# EAGLE design LedTester (EAGLE 7.3.0)
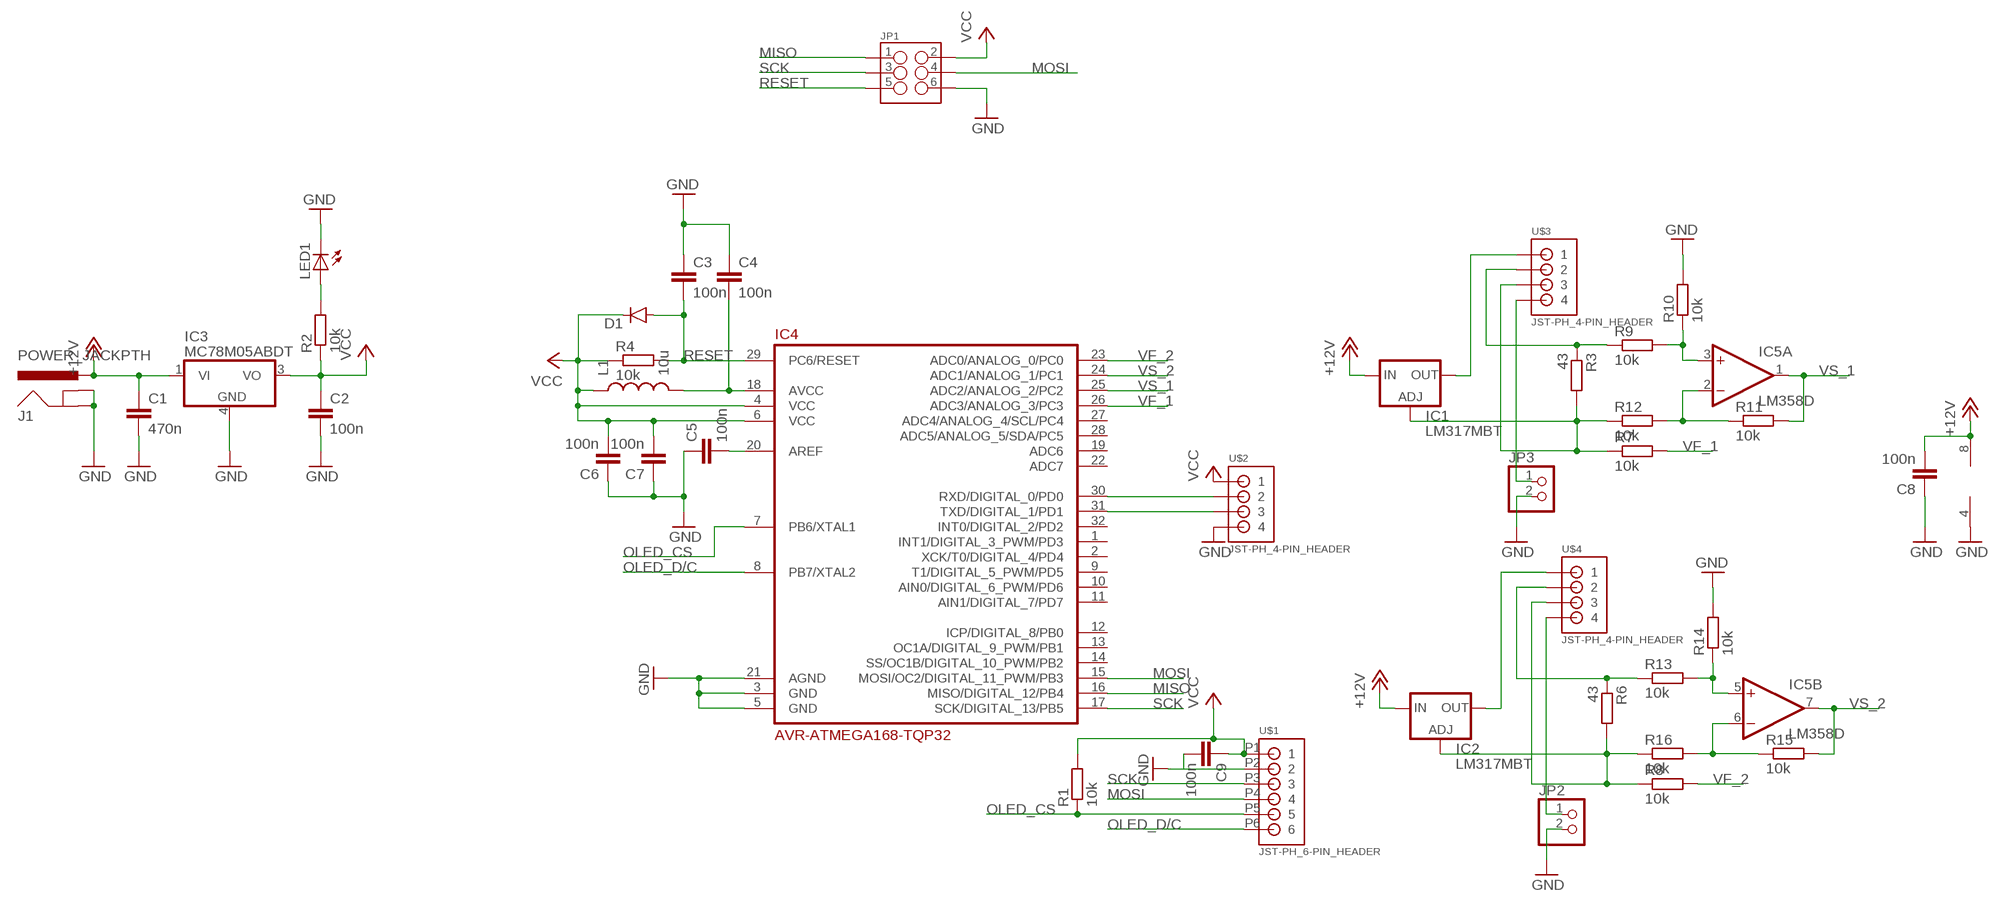
[diagram p0: schematic, sheet 1]

## Parts
C1  470n  C-EUC0603  [C0603]
C2  100n  C-EUC0603  [C0603]
C3  100n  C-EUC0603  [C0603]
C4  100n  C-EUC0603  [C0603]
C5  100n  C-EUC0603  [C0603]
C6  100n  C-EUC0603  [C0603]
C7  100n  C-EUC0603  [C0603]
C8  100n  C-EUC0603  [C0603]
C9  100n  C-EUC0603  [C0603]
D1  DIODESOD  [SOD-323]
IC1  LM317MBT  [TO220L1]
IC2  LM317MBT  [TO220L1]
IC3  MC78M05ABDT  [DPACK_3]
IC4  AVR-ATMEGA168-TQP32  [QFP32]
IC5  LM358D  [SO08]
J1  POWER_JACKPTH  [POWER_JACK_PTH]
JP1  M03X2SHROUD  [2X3-SHROUDED]
JP2  PINHD-1X2  [1X02]
JP3  PINHD-1X2  [1X02]
L1  10u  INDUCTOR0603  [0603]
LED1  LEDCHIP-LED0603  [CHIP-LED0603]
R1  10k  R-EU_R0603  [R0603]
R2  10k  R-EU_R0603  [R0603]
R3  43  R-EU_R0603  [R0603]
R4  10k  R-EU_R0603  [R0603]
R6  43  R-EU_R0603  [R0603]
R7  10k  R-EU_R0603  [R0603]
R8  10k  R-EU_R0603  [R0603]
R9  10k  R-EU_R0603  [R0603]
R10  10k  R-EU_R0603  [R0603]
R11  10k  R-EU_R0603  [R0603]
R12  10k  R-EU_R0603  [R0603]
R13  10k  R-EU_R0603  [R0603]
R14  10k  R-EU_R0603  [R0603]
R15  10k  R-EU_R0603  [R0603]
R16  10k  R-EU_R0603  [R0603]
U$1  JST-PH_6-PIN_HEADER  [JST_B6B-PH_HEADER]
U$2  JST-PH_4-PIN_HEADER  [JST_B4B-PH_HEADER]
U$3  JST-PH_4-PIN_HEADER  [JST_B4B-PH_HEADER]
U$4  JST-PH_4-PIN_HEADER  [JST_B4B-PH_HEADER]

## Nets
+12V: C1.1 C8.2 IC1.3(IN) IC2.3(IN) IC3.1(VI) IC5.8(P:V+) J1.PWR
GND: C1.2 C2.2 C3.1 C4.1 C5.1 C6.1 C7.1 C8.1 C9.2 IC3.4(GND) IC4.3(GND) IC4.5(GND) IC4.21(AGND) IC5.4(P:V-) J1.GND J1.GNDBREAK JP1.6 JP2.2 JP3.2 LED1.C R10.2 R14.2 U$1.P2 U$2.P4
MISO: IC4.16(MISO/DIGITAL_12/PB4) JP1.1
MOSI: IC4.15(MOSI/OC2/DIGITAL_11_PWM/PB3) JP1.4 U$1.P4
N$1: C5.2 IC4.20(AREF)
N$3: IC1.2(OUT) U$3.P1
N$4: C4.2 IC4.18(AVCC) L1.2
N$5: R3.1 R9.1 U$3.P2
N$6: IC1.1(ADJ) R3.2 R7.1 R12.1 U$3.P3
N$7: IC2.2(OUT) U$4.P1
N$8: R6.1 R13.1 U$4.P2
N$9: IC2.1(ADJ) R6.2 R8.1 R16.1 U$4.P3
N$10: LED1.A R2.2
N$11: IC4.30(RXD/DIGITAL_0/PD0) U$2.P2
N$12: IC4.31(TXD/DIGITAL_1/PD1) U$2.P3
N$13: IC5.2(A:-IN) R11.1 R12.2
N$14: IC5.3(A:+IN) R9.2 R10.1
N$15: IC5.6(B:-IN) R15.1 R16.2
N$16: IC5.5(B:+IN) R13.2 R14.1
N$17: JP3.1 U$3.P4
N$18: JP2.1 U$4.P4
OLED_CS: IC4.7(PB6/XTAL1) R1.1 U$1.P5
OLED_D/C: IC4.8(PB7/XTAL2) U$1.P6
RESET: C3.2 D1.A IC4.29(PC6/RESET) JP1.5 R4.2
SCK: IC4.17(SCK/DIGITAL_13/PB5) JP1.3 U$1.P3
VCC: C2.1 C6.2 C7.2 C9.1 D1.C IC3.3(VO) IC4.4(VCC) IC4.6(VCC) JP1.2 L1.1 R1.2 R2.1 R4.1 U$1.P1 U$2.P1
VF_1: IC4.26(ADC3/ANALOG_3/PC3) R7.2
VF_2: IC4.23(ADC0/ANALOG_0/PC0) R8.2
VS_1: IC4.25(ADC2/ANALOG_2/PC2) IC5.1(A:OUT) R11.2
VS_2: IC4.24(ADC1/ANALOG_1/PC1) IC5.7(B:OUT) R15.2
Unconnected: IC4.1(INT1/DIGITAL_3_PWM/PD3) IC4.2(XCK/T0/DIGITAL_4/PD4) IC4.9(T1/DIGITAL_5_PWM/PD5) IC4.10(AIN0/DIGITAL_6_PWM/PD6) IC4.11(AIN1/DIGITAL_7/PD7) IC4.12(ICP/DIGITAL_8/PB0) IC4.13(OC1A/DIGITAL_9_PWM/PB1) IC4.14(SS/OC1B/DIGITAL_10_PWM/PB2) IC4.19(ADC6) IC4.22(ADC7) IC4.27(ADC4/ANALOG_4/SCL/PC4) IC4.28(ADC5/ANALOG_5/SDA/PC5) IC4.32(INT0/DIGITAL_2/PD2)

## Library data of the parts
C1-C9 = rcl:C-EU: CAPACITOR, European symbol
D1 = SparkFun-DiscreteSemi:DIODE: Diode These are standard reverse protection diodes and small signal diodes. SMA package can handle up to about 1A. SOD-323 can handle about 200mA. What the SOD-323 package when ordering, there are some mfgs out there that are 5-pin packages.; PROD_ID: DIO-09646
IC1 IC2 = v-reg:LM317?*: 500 mA Adjustable Output Positive Voltage Regulator Source: http://www.onsemi.co.jp .. LM317M-D.PDF
IC3 = linear:MC78M: 500 mA Positive Voltage Regulators Source: Data sheet <http://www.onsemi.com/pub_link/Collateral/MC78M00-D.PDF>
IC4 = tidyeagle:AVR-ATMEGA168-TQP32: Atmel 8-bit Microcontroller in TQFP32 package. Datasheet: Summary <http://www.atmel.com/dyn/resources/prod_documents/8271S.pdf>, Full <http://www.atmel.com/dyn/resources/prod_documents/doc8271.pdf> Application Notes: AVR042 - Hardware Design Considerations <http://atmel.com/dyn/resources/prod_documents/doc2521.pdf> Supports the following chips - ATmega48PA ATmega88PA ATmega168PA ATmega328P With Arduino pin labelling.
IC5 = linear:LM358: OP AMP also LM158; LM258; LM2904 Source: http://cache.national.com/ds/LM/LM158.pdf
J1 = SparkFun-Connectors:POWER_JACK: Power Jack This is the standard 5.5mm barrel jack for power. The PTH is the most common, proven, reliable, footprint. The Slot footprint only works if the mill layer is transmitted to the PCB fab house so be warned. Mating wall wart : TOL-00298 (and others); PROD_ID: PRT-00119
JP1 = SparkFun-Connectors:M03X2: 2x3 .1" header. Shrouded, with keying- CONN-10681 SMT- CONN-11415 Pogo pins- HW-11044; PROD_ID: CONN-10681
JP2 JP3 = pinhead:PINHD-1X2: PIN HEADER
L1 = SparkFun-Passives:INDUCTOR: Inductors Basic Inductor/Choke - 0603 and 1206. Footprints are not proven and vary greatly between part numbers. SRN6045- 33uH, 20% 1.4A SDR0403-560KL - 56uH, 10%, 500mA RMS/740mA peak
LED1 = adafruit:LED: LED OSRAM: - CHIPLED LG R971, LG N971, LY N971, LG Q971, LY Q971, LO R971, LY R971 LH N974, LH R974 LS Q976, LO Q976, LY Q976 LO Q996 - Hyper CHIPLED LW Q18S LB Q993, LB Q99A, LB R99A - SideLED LS A670, LO A670, LY A670, LG A670, LP A670 LB A673, LV A673, LT A673, LW A673 LH A674 LY A675 LS A676, LA A676, LO A676, LY A676, LW A676 LS A679, LY A679, LG A679 - Hyper Micro SIDELED® LS Y876, LA Y876, LO Y876, LY Y876 LT Y87S - SmartLED LW L88C, LW L88S LB L89C, LB L89S, LG L890 LS L89K, LO L89K, LY L89K LS L896, LA L896, LO L896, LY L896 - TOPLED LS T670, LO T670, LY T670, LG T670, LP T670 LSG T670, LSP T670, LSY T670, LOP T670, LYG T670 LG T671, LOG T671, LSG T671 LB T673, LV T673, LT T673, LW T673 LH T674 LS T676, LA T676, LO T676, LY T676, LB T676, LH T676, LSB T676, LW T676 LB T67C, LV T67C, LT T67C, LS T67K, LO T67K, LY T67K, LW E67C LS E67B, LA E67B, LO E67B, LY E67B, LB E67C, LV E67C, LT E67C LW T67C LS T679, LY T679, LG T679 LS T770, LO T770, LY T770, LG T770, LP T770 LB T773, LV T773, LT T773, LW T773 LH T774 LS E675, LA E675, LY E675, LS T675 LS T776, LA T776, LO T776, LY T776, LB T776 LHGB T686 LT T68C, LB T68C - Hyper Mini TOPLED® LB M676 - Mini TOPLED Santana® LG M470 LS M47K, LO M47K, LY M47K Source: http://www.osram.convergy.de/
R1-R4 R6-R16 = resistor:R-EU_: RESISTOR, European symbol
U$1 = SRG:JST-PH_6-PIN_HEADER
U$2-U$4 = SRG:JST-PH_4-PIN_HEADER: 4-pin JST PH Shrouded Header, top entry P/N B4B-PH-K-S Mating connector PHR-4 Mating cable assembly: Sparkfun PRT-09916 <http://www.sparkfun.com/products/9916>

## Board
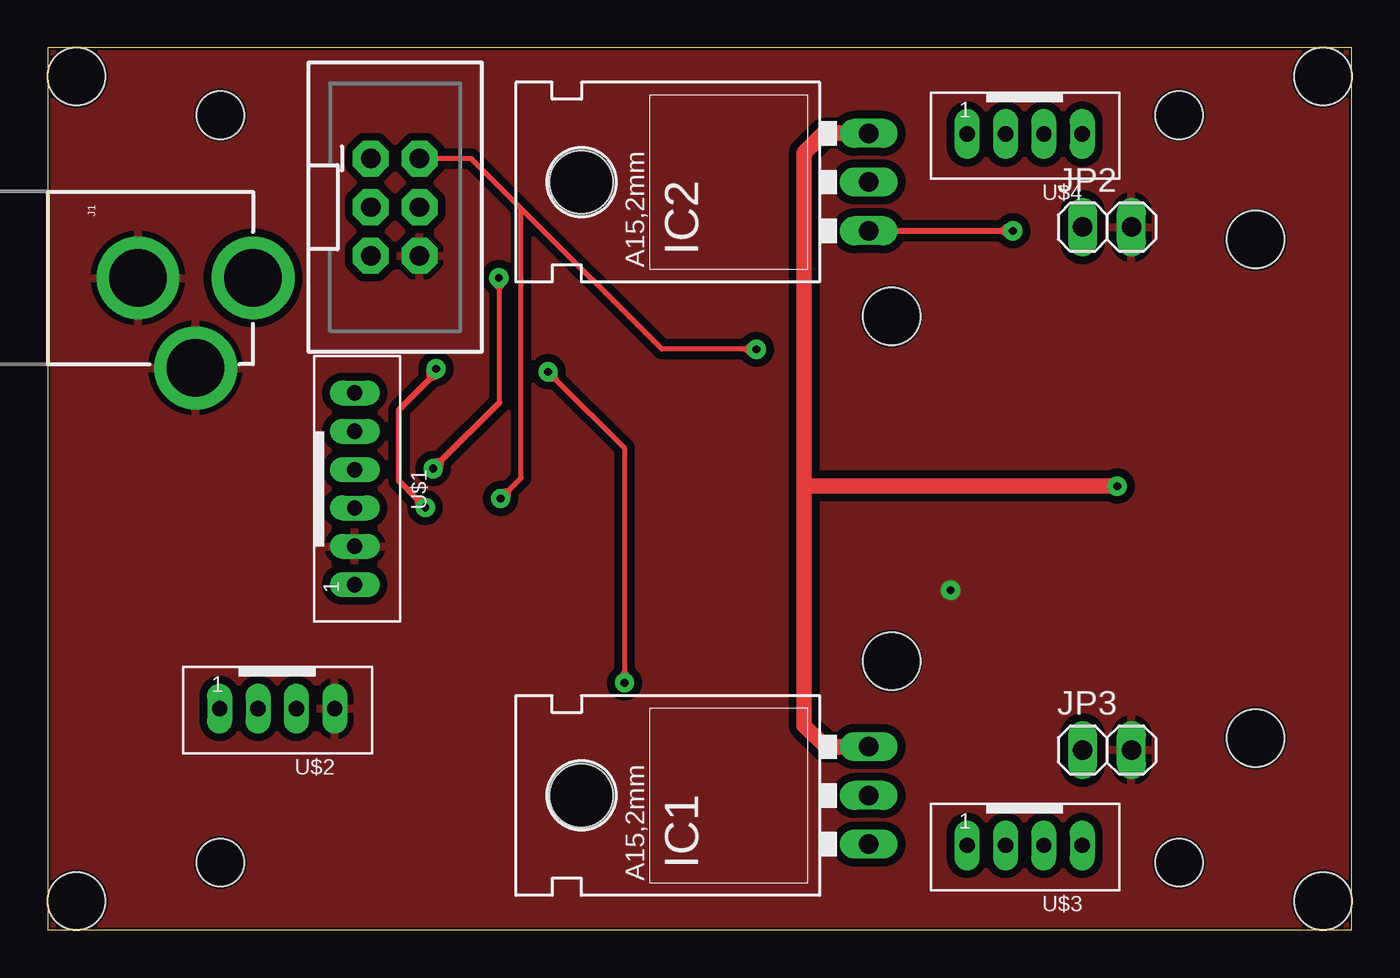
[diagram p1: board, top side]
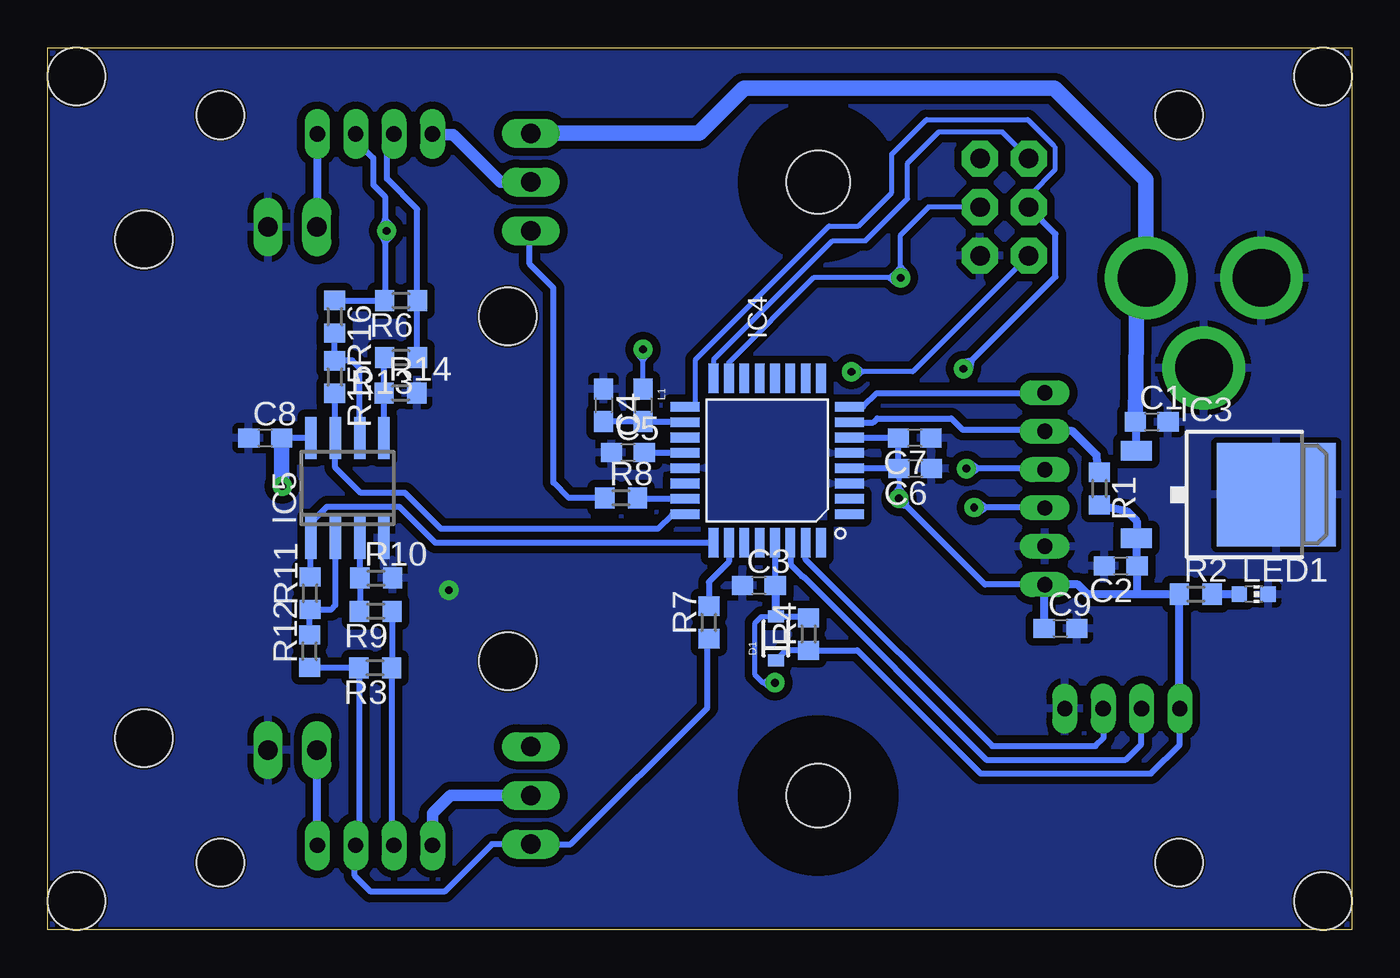
[diagram p2: board, bottom side, seen from below]

Size 68 x 46 mm. Coordinates in mm from the lower left corner, seen from the top.
Outline: 0,0 68,0 68,46 0,46 0,0
Copper layers (1*16): Top 0.035mm / dielectric 1.5mm / Bottom 0.035mm
Design rules "default": minimum track width 8mil, minimum drill 0.5mm, track to track 16mil, track to pad 12mil, pad to pad 10mil, via to via 10mil, smd to smd 8mil, copper to edge 5mil, drill to drill 8mil, minimum pad ring 10mil, minimum via ring 12mil, stop-mask expansion 4mil, vias tented up to drill 0mil, thermal gap 12mil
Holes 3 mm at 1.5,1.5 1.5,44.5 66.5,44.5 66.5,1.5 63,36 63,10 44,32 44,14
Holes 2.5 mm at 9,3.5 9,42.5 59,3.5 59,42.5
bKeepout: area 60,33 to 66,39; area 60,7 to 66,13

### Footprints (pad centres in the part's own frame; a part is rotated, then mirrored left to right if it is on the bottom)
C0603 = smd 1.1 x 1: 1 -0.85,0; 2 0.85,0
SOD-323 = smd 0.63 x 0.83: A 1.15,0; C -1.15,0
TO220L1 = drill 1.016 long: 1 -2.54,-3.81; 2 0,-3.81; 3 2.54,-3.81 | hole 3.302: 0,11.176
DPACK_3 = smd 1 x 1.6: 1 -2.28,-4.8; 3 2.28,-4.8 | smd 5.4 x 6.2: 4 0,2.5
QFP32 = smd 0.508 x 1.524: 1 -2.8,-4.293; 2 -2,-4.293; 3 -1.2,-4.293; 4 -0.4,-4.293; 5 0.4,-4.293; 6 1.2,-4.293; 7 2,-4.293; 8 2.8,-4.293; 17 2.8,4.293; 18 2,4.293; 19 1.2,4.293; 20 0.4,4.293; 21 -0.4,4.293; 22 -1.2,4.293; 23 -2,4.293; 24 -2.8,4.293 | smd 1.524 x 0.508: 9 4.293,-2.8; 10 4.293,-2; 11 4.293,-1.2; 12 4.293,-0.4; 13 4.293,0.4; 14 4.293,1.2; 15 4.293,2; 16 4.293,2.8; 25 -4.293,2.8; 26 -4.293,2; 27 -4.293,1.2; 28 -4.293,0.4; 29 -4.293,-0.4; 30 -4.293,-1.2; 31 -4.293,-2; 32 -4.293,-2.8
SO08 = smd 0.6 x 2.2: 1 -1.905,-2.6; 2 -0.635,-2.6; 3 0.635,-2.6; 4 1.905,-2.6; 5 1.905,2.6; 6 0.635,2.6; 7 -0.635,2.6; 8 -1.905,2.6
POWER_JACK_PTH = drill 2.997 pad 4.318: GND 0,7.7; GNDBREAK 4.7,10.7; PWR 0,13.7
2X3-SHROUDED = drill 1.016 pad 1.88 octagon: 1 -1.27,2.54; 2 1.27,2.54; 3 -1.27,0; 4 1.27,0; 5 -1.27,-2.54; 6 1.27,-2.54
1X02 = drill 1.016 long: 1 -1.27,0; 2 1.27,0
0603 = smd 1.1 x 1: 1 -0.85,0; 2 0.85,0
CHIP-LED0603 = smd 0.8 x 0.8: A 0,-0.75; C 0,0.75
R0603 = smd 1 x 1.1: 1 -0.85,0; 2 0.85,0
JST_B6B-PH_HEADER = drill 0.8 long: P1 5,0; P2 3,0; P3 1,0; P4 -1,0; P5 -3,0; P6 -5,0
JST_B4B-PH_HEADER = drill 0.8 long: P1 2.98,0.048; P2 0.98,0.048; P3 -1.02,0.048; P4 -3.02,0.048

### Placement (x,y rotation side)
C1  10.42,26.49 0 bottom
C2  12.04,18.97 180 bottom
C3  30.91,17.96 0 bottom
C4  39.01,27.36 270 bottom
C5  37.74,24.89 0 bottom
C6  22.76,24.05 180 bottom
C7  22.78,25.65 180 bottom
C8  56.67,25.65 0 bottom
C9  15.19,15.72 0 bottom
D1  30.02,15.19 90 bottom
IC1  39,7 90 top
IC2  39,39 90 top
IC3  6.43,22.7 270 bottom
IC4  30.48,24.48 90 bottom
IC5  52.37,23.04 0 bottom
J1  -3,34 270 top
JP1  18.11,37.69 0 top
JP2  55.24,36.65 0 top
JP3  55.24,9.37 0 top
L1  36.96,27.36 270 bottom
LED1  5.11,17.5 270 bottom
R1  13.16,23.01 270 bottom
R2  8.13,17.5 0 bottom
R3  50.93,13.67 180 bottom
R4  28.32,15.42 90 bottom
R6  49.58,32.82 180 bottom
R7  33.53,16.03 90 bottom
R8  38.1,22.53 0 bottom
R9  50.9,16.61 180 bottom
R10  50.88,18.34 0 bottom
R11  54.33,17.55 90 bottom
R12  54.36,14.53 90 bottom
R13  49.58,29.84 180 bottom
R14  49.61,27.99 0 bottom
R15  53.04,28.83 270 bottom
R16  53.04,31.98 270 bottom
U$1  16,23 270 top
U$2  11.94,11.58 180 top
U$3  50.93,4.45 180 top
U$4  50.93,41.55 180 top

### Tracks (layer width: path | path; a pad name or v marks a point on that pad's centre or on a via)
+12V  (via drill 0.4)
  Top 0.813: IC2.3 40.47,41.54 39.45,40.51 39.45,23.14 | 39.45,23.14 39.45,10.67 40.59,9.53 42.8,9.53 IC1.3 | v55.78,23.14 39.45,23.14
  Bottom 0.305: IC5.8 55.81,25.64 C8.2
  Bottom 0.406: IC3.1 11.23,26.67 C1.1
  Bottom 0.813: C1.1 11.21,33.49 J1.PWR 10.72,34.02 10.72,39.12 15.49,43.89 31.7,43.89 34.05,41.54 IC2.3 | v55.78,23.14 55.73,23.19 55.82,23.19 C8.2
GND  (via drill 0.4)
  other vias: 47.09,17.7
  pour Bottom: 0,0 0,46 68,46 68,0
  pour Top: 0,0 0,46 68,46 68,0
MISO
  Bottom 0.254: JP1.1 18.21,41.6 21.54,41.6 23.16,39.98 23.16,38.12 25.35,35.94 27.08,35.94 33.28,29.74 IC4.16
MOSI  (via drill 0.4)
  Top 0.254: 23.55,27.51 23.55,33.41 | 23.55,33.41 23.55,33.98 v23.52,34.01 | 23.55,33.41 23.82,33.78 v23.52,34.01 | 23.55,33.41 23.24,33.76 v23.52,34.01
  Top 0.305: v20.09,24.05 20.52,24.48 | 20.52,24.48 23.55,27.51 | 20.52,24.48 20.04,24.4 v20.09,24.05 | 20.52,24.48 20.44,24 v20.09,24.05
  Bottom 0.254: JP1.4 22.07,37.69 23.52,36.25 23.52,34.61 | IC4.15 32.49,29.59 28.07,34.01 24.12,34.01 | v23.52,34.01 24.12,34.01 | 24.12,34.01 | v23.52,34.01 23.52,34.61 | 23.52,34.61 | 24.12,34.01 23.76,34.3 | v23.52,34.01 23.76,34.3 | 24.12,34.01 | 24.12,34.01 23.76,33.72 | v23.52,34.01 23.76,33.72 | 23.52,34.61 | 23.52,34.61 23.23,34.25 | v23.52,34.01 23.23,34.25 | 23.52,34.61 23.81,34.25 | v23.52,34.01 23.81,34.25 | 24.12,34.01 23.76,34.3 | 23.76,34.3 | v23.52,34.01 23.76,34.3 | 24.12,34.01 23.76,33.72 | v23.52,34.01 23.76,33.72 | 24.12,34.01 23.76,34.3 | v23.52,34.01 23.76,34.3 | 24.12,34.01 23.76,33.72 | v23.52,34.01 23.76,33.72 | 23.52,34.61 23.23,34.25 | 23.23,34.25 | v23.52,34.01 23.23,34.25 | 23.52,34.61 23.81,34.25 | v23.52,34.01 23.81,34.25 | 23.52,34.61 23.23,34.25 | v23.52,34.01 23.23,34.25 | 23.52,34.61 23.81,34.25 | v23.52,34.01 23.81,34.25
  Bottom 0.305: U$1.P4 16.05,24.05 19.49,24.05 | 19.49,24.05 | 19.49,24.05 v20.09,24.05 | 19.49,24.05 | 19.49,24.05 19.88,23.77 | 19.88,23.77 | 19.49,24.05 19.88,24.34 | 19.88,24.34 | 19.49,24.05 19.88,23.77 | v20.09,24.05 19.88,23.77 | 19.49,24.05 19.88,24.34 | v20.09,24.05 19.88,24.34 | 19.49,24.05 19.88,23.77 | v20.09,24.05 19.88,23.77 | 19.49,24.05 19.88,24.34 | v20.09,24.05 19.88,24.34
N$1
  Bottom 0.305: IC4.20 36.89,24.88 C5.2
N$2
  pour Bottom: 0,0 0,46 68,46 68,0
N$3
  Bottom 0.61: IC1.2 47,7 47.93,6.07 47.93,4.42 U$3.P1
N$4
  Bottom 0.305: IC4.18 36.96,26.48 L1.2 C4.2
N$5
  Bottom 0.305: R9.1 50.05,13.69 R3.1 50.08,4.53 U$3.P2
N$6
  Bottom 0.305: R12.1 54.34,13.66 R3.2 51.78,4.57 U$3.P3 51.99,4.35 51.99,2.82 51.16,1.98 47.32,1.98 44.84,4.46 IC1.1 40.73,4.46 33.6,11.58 33.6,15.1 R7.1
N$7
  Bottom 0.305: 47.92,41.48 U$4.P1
  Bottom 0.61: IC2.2 44.38,39 46.86,41.48 47.92,41.48
N$8
  Bottom 0.305: R13.1 R6.1 48.73,37.58 50.32,39.17 50.32,41.5 U$4.P2
N$9  (via drill 0.4)
  Top 0.305: IC2.1 49.73,36.46 | 49.73,36.46 | 49.73,36.46 v50.33,36.46 | 49.73,36.46 | 49.73,36.46 50.12,36.17 | 50.12,36.17 | 49.73,36.46 50.12,36.74 | 50.12,36.74 | 49.73,36.46 50.12,36.17 | v50.33,36.46 50.12,36.17 | 49.73,36.46 50.12,36.74 | v50.33,36.46 50.12,36.74 | 49.73,36.46 50.12,36.17 | v50.33,36.46 50.12,36.17 | 49.73,36.46 50.12,36.74 | v50.33,36.46 50.12,36.74
  Bottom 0.305: R16.1 50.44,32.83 R6.2 50.42,32.97 50.42,35.87 | 50.42,37.05 50.42,38.25 51.03,38.86 51.03,40.26 51.94,41.17 U$4.P3 | 50.42,37.05 50.42,36.37 | 50.42,36.37 50.42,35.87 | R8.1 40.84,22.53 41.63,23.32 41.63,33.48 42.88,34.72 42.88,36.4 IC2.1 | v50.33,36.46 50.42,36.37 | 50.42,37.05 50.08,36.71 v50.33,36.46 | 50.42,37.05 50.64,36.62 v50.33,36.46 | 50.42,35.87 50.64,36.3 v50.33,36.46 | 50.42,35.87 50.08,36.21 v50.33,36.46
N$10
  Bottom 0.406: LED1.A R2.2
N$11
  Bottom 0.305: IC4.30 29.28,19.04 28.68,18.44 28.55,18.36 19.05,8.87 11.79,8.87 10.97,9.68 10.97,11.53 U$2.P2
N$12
  Bottom 0.305: IC4.31 28.47,20.17 28.47,19.3 18.75,9.58 13.36,9.58 12.93,10.01 12.93,11.51 U$2.P3
N$13
  Bottom 0.305: R12.2 54.36,16.68 R11.1 54.32,16.69 53.24,16.69 53.01,16.92 IC5.2
N$14
  Bottom 0.305: IC5.3 51.73,20.43 R10.1 51.73,16.64 R9.2
N$15
  Bottom 0.305: IC5.6 51.74,29.31 52.12,29.69 53.02,29.69 R15.1 R16.2
N$16
  Bottom 0.305: IC5.5 50.47,27.98 R14.1 50.46,29.82 R13.2
N$17
  Bottom 0.406: U$3.P4 53.95,9.35 JP3.1
N$18
  Bottom 0.406: U$4.P4 53.95,36.68 JP2.1
N$19
  pour Top: 0,0 0,46 68,46 68,0
OLED_CS
  Bottom 0.305: U$1.P5 16.18,26.09 20.3,26.09 20.88,26.67 24.74,26.67 24.94,26.47 26.16,26.47 IC4.7
  Bottom 0.406: R1.1 13.31,24.77 14.55,26.01 U$1.P5
OLED_D/C
  Bottom 0.305: U$1.P6 24.77,27.99 25.48,27.28 26.16,27.28 IC4.8
RESET  (via drill 0.4)
  Top 0.254: v26.09,29.11 26.51,28.68 | 26.51,28.68 30.07,25.12 30.07,13.48 | 30.07,13.48 | 30.07,13.48 v30.07,12.88 | 26.51,28.68 26.46,29.15 v26.09,29.11 | 26.51,28.68 26.05,28.73 v26.09,29.11 | 30.07,13.48 | 30.07,13.48 29.78,13.12 | v30.07,12.88 29.78,13.12 | 30.07,13.48 30.37,13.12 | v30.07,12.88 30.37,13.12 | 30.07,13.48 29.78,13.12 | 29.78,13.12 | v30.07,12.88 29.78,13.12 | 30.07,13.48 30.37,13.12 | v30.07,12.88 30.37,13.12 | 30.07,13.48 29.78,13.12 | v30.07,12.88 29.78,13.12 | 30.07,13.48 30.37,13.12 | v30.07,12.88 30.37,13.12
  Bottom 0.254: JP1.5 22.89,29.11 25.49,29.11 | 25.49,29.11 | 25.49,29.11 v26.09,29.11 | v30.07,12.88 30.67,12.88 | 30.67,12.88 | 30.67,12.88 30.71,12.88 31.11,13.28 31.11,16 30.79,16.33 D1.A | 25.49,29.11 | 25.49,29.11 25.85,28.82 | v26.09,29.11 25.85,28.82 | 25.49,29.11 25.85,29.4 | v26.09,29.11 25.85,29.4 | 25.49,29.11 25.85,28.82 | 25.85,28.82 | v26.09,29.11 25.85,28.82 | 25.49,29.11 25.85,29.4 | v26.09,29.11 25.85,29.4 | 25.49,29.11 25.85,28.82 | v26.09,29.11 25.85,28.82 | 25.49,29.11 25.85,29.4 | v26.09,29.11 25.85,29.4 | 30.67,12.88 30.31,13.17 | v30.07,12.88 30.31,13.17 | 30.67,12.88 | 30.67,12.88 30.31,12.58 | v30.07,12.88 30.31,12.58 | 30.67,12.88 30.31,13.17 | 30.31,13.17 | v30.07,12.88 30.31,13.17 | 30.67,12.88 30.31,12.58 | v30.07,12.88 30.31,12.58 | 30.67,12.88 30.31,13.17 | v30.07,12.88 30.31,13.17 | 30.67,12.88 30.31,12.58 | v30.07,12.88 30.31,12.58
  Bottom 0.305: IC4.29 30.08,17.97 | D1.A 28.39,16.34
  Bottom 0.406: 30.08,17.97 C3.2 30.02,17.92 D1.A | 28.39,16.34 R4.2
SCK  (via drill 0.4)
  Top 0.305: v19.68,22.02 19.26,22.45 | 19.26,22.45 18.31,23.39 18.31,27.13 19.93,28.75 | 19.93,28.75 20.32,29.13 v20.24,29.26 | 19.26,22.45 19.34,21.97 v19.68,22.02 | 19.26,22.45 19.74,22.37 v19.68,22.02 | 19.93,28.75 20.38,28.94 v20.24,29.26 | 19.93,28.75 19.89,29.23 v20.24,29.26
  Bottom 0.254: IC4.17 34.75,27.28 34.24,27.28 34.21,27.3 34.21,29.74 27.25,36.7 25.73,36.7 23.98,38.46 23.98,40.46 22.17,42.27 16.89,42.27 15.54,40.92 15.47,40.82 15.47,39.65 16.76,38.35 16.76,37.82 JP1.3
  Bottom 0.305: U$1.P3 16.02,22.02 19.09,22.02 | 19.09,22.02 | 19.09,22.02 v19.68,22.02 | v20.24,29.26 19.82,29.68 | 19.82,29.68 15.44,34.06 15.44,36.3 JP1.3 | 19.09,22.02 | 19.09,22.02 19.48,21.74 | 19.48,21.74 | 19.09,22.02 19.48,22.31 | 19.48,22.31 | 19.09,22.02 19.48,21.74 | v19.68,22.02 19.48,21.74 | 19.09,22.02 19.48,22.31 | v19.68,22.02 19.48,22.31 | 19.09,22.02 19.48,21.74 | v19.68,22.02 19.48,21.74 | 19.09,22.02 19.48,22.31 | v19.68,22.02 19.48,22.31 | 19.82,29.68 19.9,29.2 v20.24,29.26 | 19.82,29.68 20.3,29.61 v20.24,29.26
VCC  (via drill 0.4)
  Top 0.254: v36.96,30.28 36.36,30.28 | 36.36,30.28 | 36.36,30.28 32.03,30.28 24.69,37.62 | 24.69,37.62 22.07,40.23 JP1.2 | v23.61,22.49 24.03,22.91 | 24.03,22.91 24.69,23.57 24.69,37.62 | 36.36,30.28 | 36.36,30.28 36.72,29.98 | v36.96,30.28 36.72,29.98 | 36.36,30.28 36.72,30.57 | v36.96,30.28 36.72,30.57 | 36.36,30.28 36.72,29.98 | 36.72,29.98 | v36.96,30.28 36.72,29.98 | 36.36,30.28 36.72,30.57 | v36.96,30.28 36.72,30.57 | 36.36,30.28 36.72,29.98 | v36.96,30.28 36.72,29.98 | 36.36,30.28 36.72,30.57 | v36.96,30.28 36.72,30.57 | 24.03,22.91 23.57,22.87 v23.61,22.49 | 24.03,22.91 23.98,22.45 v23.61,22.49
  Bottom 0.254: 36.69,28.47 L1.1 36.96,29.68 | 36.96,29.68 | 36.96,29.68 v36.96,30.28 | 24.11,24.08 23.61,23.57 23.61,23.09 | 23.61,23.09 | 23.61,23.09 v23.61,22.49 | 36.96,29.68 37.25,30.04 | v36.96,30.28 37.25,30.04 | 36.96,29.68 | 36.96,29.68 36.66,30.04 | v36.96,30.28 36.66,30.04 | 36.96,29.68 37.25,30.04 | 37.25,30.04 v36.96,30.28 | 36.96,29.68 36.66,30.04 | v36.96,30.28 36.66,30.04 | 36.96,29.68 37.25,30.04 | v36.96,30.28 37.25,30.04 | 36.96,29.68 36.66,30.04 | v36.96,30.28 36.66,30.04 | 23.61,23.09 | 23.61,23.09 23.32,22.73 | v23.61,22.49 23.32,22.73 | 23.61,23.09 23.9,22.73 | v23.61,22.49 23.9,22.73 | 23.61,23.09 23.32,22.73 | 23.32,22.73 | v23.61,22.49 23.32,22.73 | 23.61,23.09 23.9,22.73 | v23.61,22.49 23.9,22.73 | 23.61,23.09 23.32,22.73 | v23.61,22.49 23.32,22.73 | 23.61,23.09 23.9,22.73 | v23.61,22.49 23.9,22.73
  Bottom 0.305: 26.16,25.65 C7.2 23.63,24.05 C6.2 24.11,24.08 IC4.4 | D1.C 29.49,14.57 R4.1 28.19,14.58 25.78,14.58 19.36,8.15 10.46,8.15 8.97,9.65 U$2.P1 | 16.04,18 19.12,18 23.18,22.07 | v23.61,22.49 23.18,22.07 | 23.18,22.07 23.66,22.14 v23.61,22.49 | 23.18,22.07 23.26,22.55 v23.61,22.49
  Bottom 0.406: C9.1 16.04,18 U$1.P1 14.28,18.01 13.77,17.5 11.23,17.5 | U$2.P1 8.98,11.54 R2.1 11.23,17.5 | 11.23,17.5 11.19,17.54 C2.1 11.19,20.38 IC3.3 11.2,20.45 11.2,21.31 11.72,21.83 R1.2 | 26.16,25.65 IC4.6
VF_1
  Bottom 0.305: IC4.26 32.48,19.19 33.53,18.14 R7.2
VF_2
  Bottom 0.305: IC4.23 37.25,22.48 R8.2
VS_1
  Bottom 0.305: R11.2 54.33,20.39 IC5.1 54.28,20.57 54.28,21.23 53.44,22.07 49.68,22.07 47.8,20.19 33.3,20.19 IC4.25
VS_2
  Bottom 0.305: R15.2 53.01,27.95 IC5.7 53.01,24.1 51.69,22.78 49.38,22.78 47.5,20.9 36.2,20.9 35.43,21.67 34.77,21.67 IC4.24